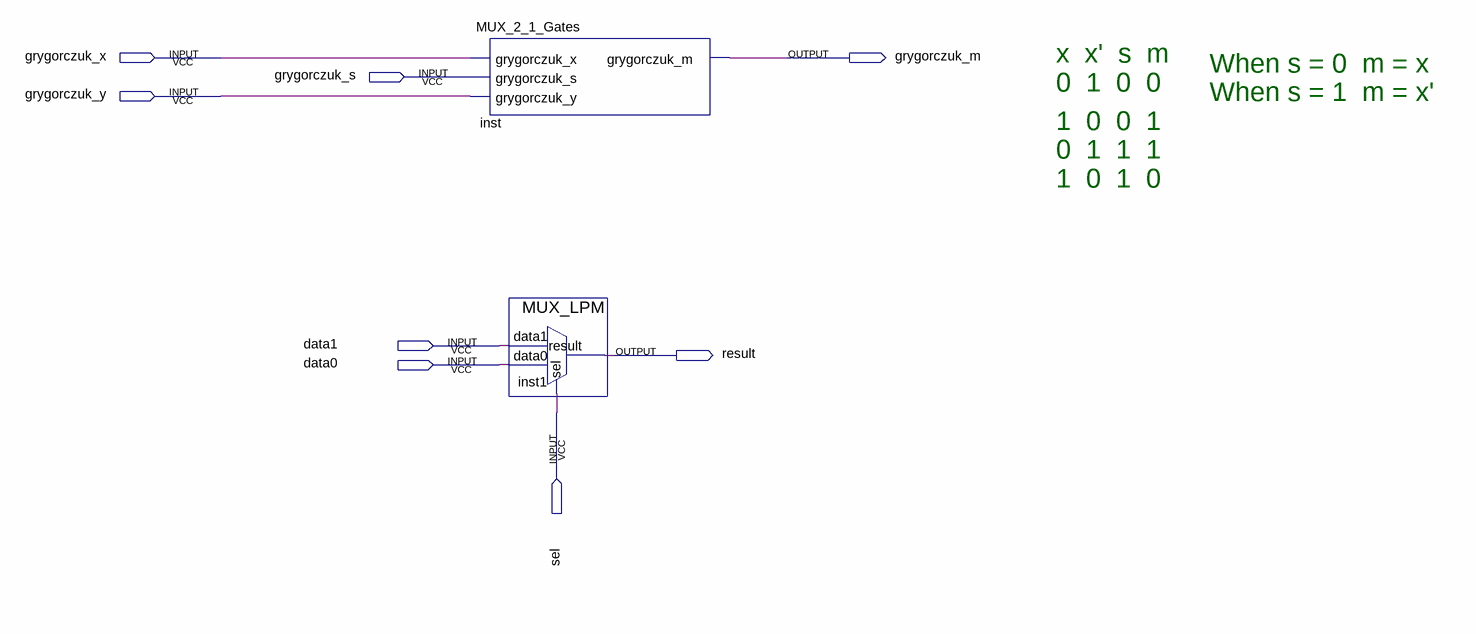
[diagram p0: schematic sheet]
// Quartus schematic MUX_2_1_SYMBOL.bdf as structural Verilog: 2 symbols, 8 pins
module MUX_2_1_SYMBOL (
  input  grygorczuk_x,
  input  grygorczuk_s,
  input  grygorczuk_y,
  input  data1,
  input  data0,
  input  sel,
  output grygorczuk_m,
  output result
);

  MUX_2_1_Gates inst (
    .grygorczuk_x(grygorczuk_x), .grygorczuk_s(grygorczuk_s), .grygorczuk_y(grygorczuk_y),
    .grygorczuk_m(grygorczuk_m));
  MUX_LPM inst1 (.data1(data1), .data0(data0), .sel(sel), .result(result));

  // Notes on the sheet:
  //   x  x'  s  m
  //   When s = 0  m = x
  //   0  1  0  0 
  //   When s = 1  m = x'
  //   1  0  0  1
  //   0  1  1  1
  //   1  0  1  0
endmodule
